# EAGLE schematic SHT21 (EAGLE 7.5.0)
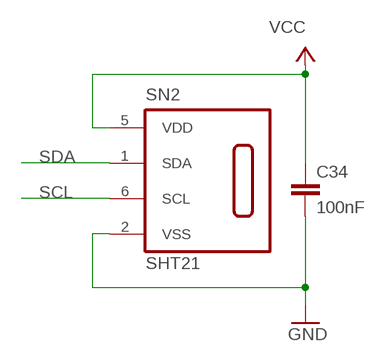
[diagram p0: schematic, sheet 1]

## Parts
C34  100nF  C-EUC0603  [C0603]
SN2  SHT21  [DFN6/SHT]

## Nets
GND: C34.2 SN2.2(VSS)
SCL: SN2.6(SCL)
SDA: SN2.1(SDA)
VCC: C34.1 SN2.5(VDD)

## Library data of the parts
C34 = rcl:C-EU: CAPACITOR, European symbol
SN2 = sensirion:SHT21: Humidity and Temperature Sensor

## Net classes
1 power: width 0.178 mm